# EAGLE design solar (EAGLE 6.5.0)
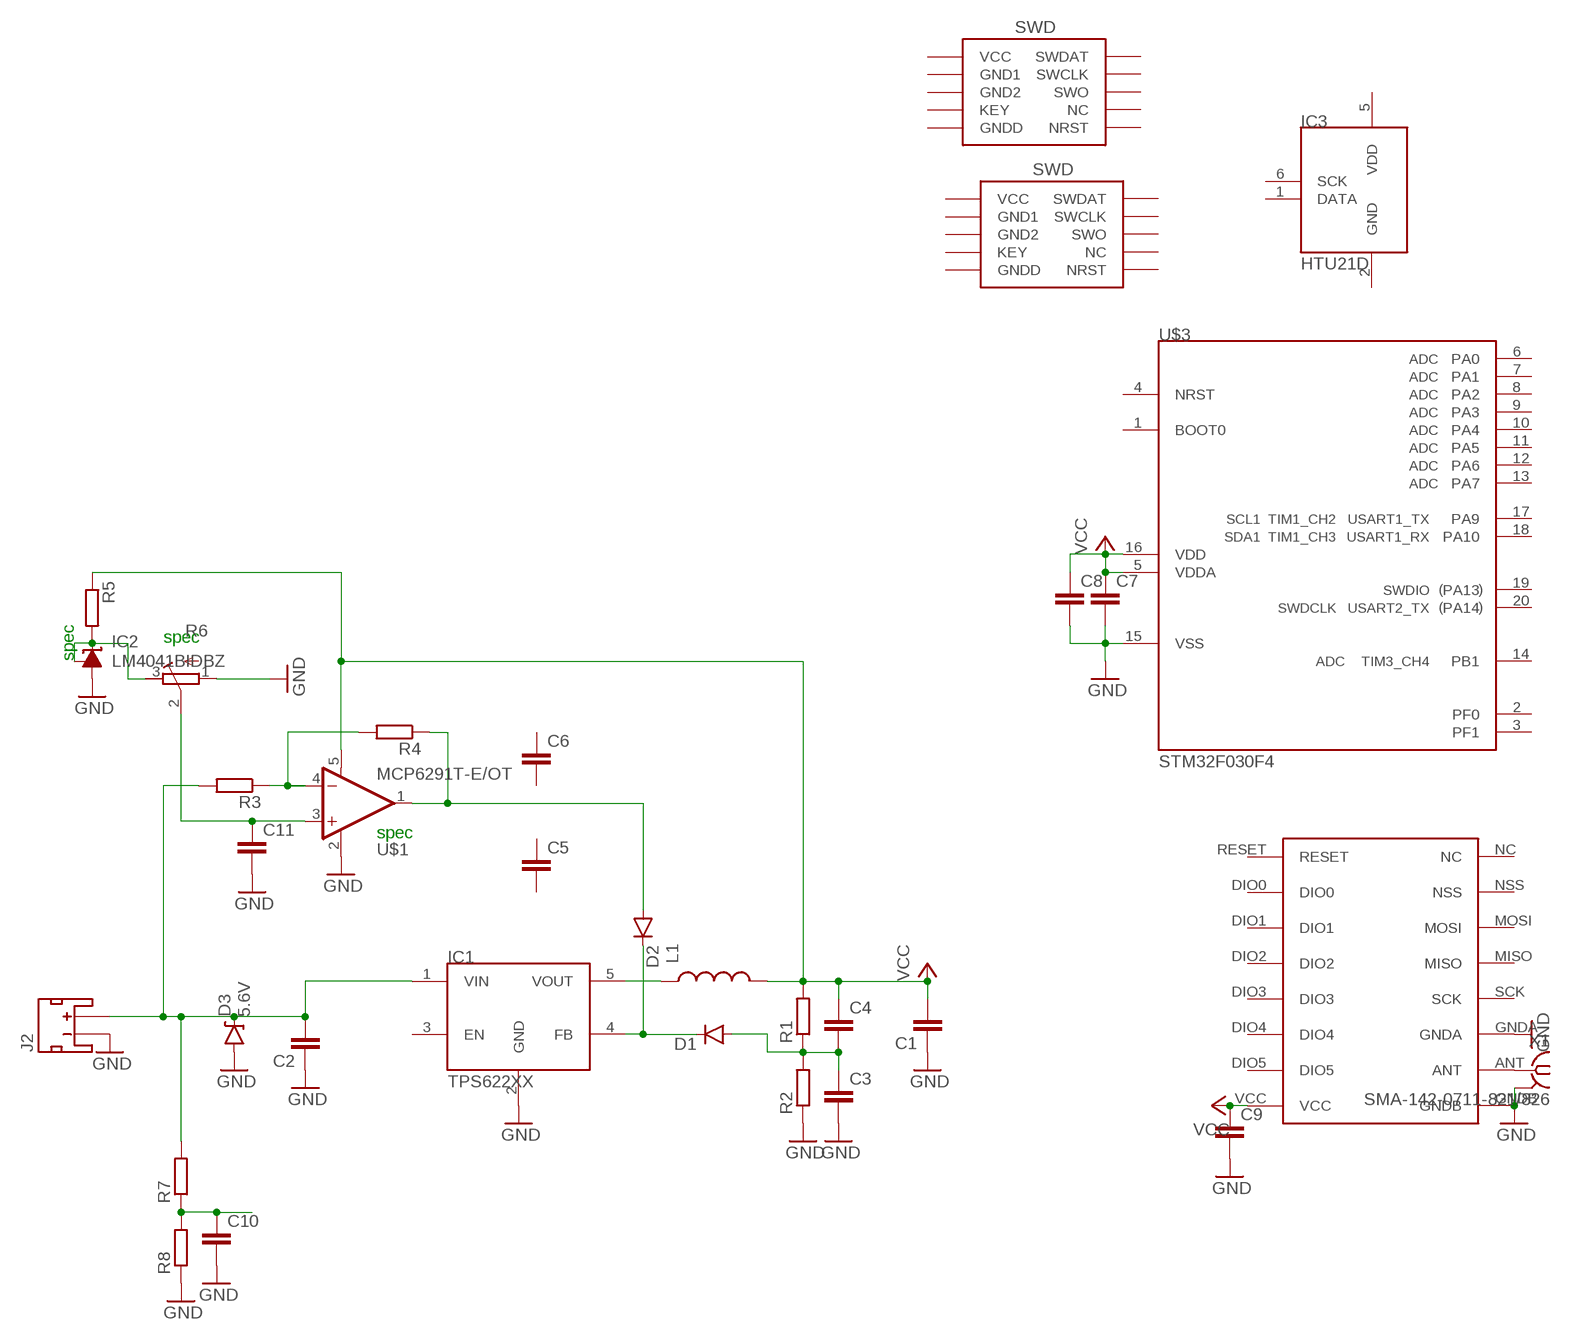
[diagram p0: schematic, sheet 1]

## Parts
C1  C-EUC0805  [C0805]
C2  C-EUC0805  [C0805]
C3  C-EUC0603  [C0603]
C4  C-EUC0603  [C0603]
C5  C-EUC0603  [C0603]
C6  C-EUC0603  [C0603]
C7  C-EUC0603  [C0603]
C8  C-EUC0603  [C0603]
C9  C-EUC0603  [C0603]
C10  C-EUC0603  [C0603]
C11  C-EUC0603  [C0603]
D1  250mA/100V  DIODEBAS16  [SOD-323]
D2  250mA/100V  DIODEBAS16  [SOD-323]
D3  5.6V  DIODE-ZENER5.6V  [SOD-323]
IC1  TPS622XX  [SOT23-5L]
IC2  LM4041BIDBZ  [DBZ_R-PDSO-G3]
IC3  HTU21D  [DFN6-L]
J1  SWD_SHROUD_SMD  [SWD_SMD_SHROUD]
J2  JST_2MM_MALE  [JST-2-SMD]
J3  SWD_SHROUD  [SWD_PTH_SHROUD]
L1  INDUCTOR1007  [1007]
R1  R-EU_R0603  [R0603]
R2  R-EU_R0603  [R0603]
R3  R-EU_R0603  [R0603]
R4  R-EU_R0603  [R0603]
R5  R-EU_R0603  [R0603]
R6  R-TRIMM3103  [RTRIM3103]
R7  R-EU_R0603  [R0603]
R8  R-EU_R0603  [R0603]
U$1  MCP6291T-E/OT  [SOT23-5]
U$3  STM32F030F4  [TSSOP20]
U$4  RFM69HW  [RFM]
X1  SMA-142-0711-821/826  [J502-ND-142-0711-821/826]

## Nets
GND: C1.1 C2.1 C3.2 C7.2 C8.2 C9.2 C10.2 C11.2 D3.A IC1.2(GND) IC2.3(A) J2.1(-) R2.1 R6.1(E) R8.1 U$1.2(V-) U$3.15(VSS) U$4.GNDA U$4.GNDB X1.G@1 X1.G@2 X1.G@3 X1.G@4
N$1: C3.1 C4.2 D1.A R1.1 R2.2
N$2: IC1.5(VOUT) L1.1
N$3: D1.C D2.C IC1.4(FB)
N$4: C2.2 D3.C IC1.1(VIN) J2.2(+) R3.2 R7.2
N$6: D2.A R4.1 U$1.1(OUT)
N$7: R3.1 R4.2 U$1.4(-IN)
N$8: C11.1 R6.2(S) U$1.3(+IN)
N$9: U$4.ANT X1.1
N$10: IC2.1(FB) IC2.2(C) R5.2 R6.3(A)
N$13: C10.1 R7.1 R8.2
VCC: C1.2 C4.1 C7.1 C8.1 C9.1 L1.2 R1.2 R5.1 U$1.5(V+) U$3.5(VDDA) U$3.16(VDD) U$4.VCC
Unconnected: C5.1 C5.2 C6.1 C6.2 IC1.3(EN) IC3.1(DATA) IC3.2(GND) IC3.5(VDD) IC3.6(SCK) J1.2(SWDAT) J1.4(SWCLK) J1.6(SWO) J1.7(KEY) J1.8(NC) J1.10(NRST) J2.NC1(PAD1) J2.NC2(PAD2) J3.2(SWDAT) J3.4(SWCLK) J3.6(SWO) J3.7(KEY) J3.8(NC) J3.10(NRST) U$3.1(BOOT0) U$3.2(PF0) U$3.3(PF1) U$3.4(NRST) U$3.6(PA0) U$3.7(PA1) U$3.8(PA2) U$3.9(PA3) U$3.10(PA4) U$3.11(PA5) U$3.12(PA6) U$3.13(PA7) U$3.14(PB1) U$3.17(PA9) U$3.18(PA10) U$3.19(PA13) U$3.20(PA14) U$4.DIO0 U$4.DIO1 U$4.DIO2 U$4.DIO3 U$4.DIO4 U$4.DIO5 U$4.MISO U$4.MOSI U$4.NC U$4.NSS U$4.RESET U$4.SCK

## Notes on the sheet
- spec
- spec
- spec

## Power pins joined to a net without a drawn wire
GND1: J1.3(GND1) J3.3(GND1)
GND2: J1.5(GND2) J3.5(GND2)
GNDD: J1.9(GNDD) J3.9(GNDD)
VCC: J1.1(VCC) J3.1(VCC)

## Library data of the parts
C1-C11 = rcl:C-EU: CAPACITOR, European symbol
D1 D2 = SparkFun-DiscreteSemi:DIODE: Diode These are standard reverse protection diodes and small signal diodes. SMA package can handle up to about 1A. SOD-323 can handle about 200mA. What the SOD-323 package when ordering, there are some mfgs out there that are 5-pin packages.; PROD_ID: DIO-09646
D3 = SparkFun-DiscreteSemi:DIODE-ZENER: Zener Diode Production Part - 8199 3.4V Zener Voltage; PROD_ID: DIO-12442
IC1 = Mine:TPS622XX
IC2 = texas:LM4041*I: PRECISION MICROPOWER SHUNT VOLTAGE REFERENCE Adjustable Output Source: http://focus.ti.com/lit/ds/slcs146e/slcs146e.pdf; OC_FARNELL: unknown; OC_NEWARK: unknown
IC3 = Mine:HTU21D
J1 J3 = dtb:SWD_SHROUD
J2 = dtb:JST_2MM_MALE: Mates to single-cell LiPo batteries. CONN-08352; PROD_ID: CONN-08352
L1 = SparkFun-Passives:INDUCTOR: Inductors Basic Inductor/Choke - 0603 and 1206. Footprints are not proven and vary greatly between part numbers. SRN6045- 33uH, 20% 1.4A SDR0403-560KL - 56uH, 10%, 500mA RMS/740mA peak
R1-R5 R7 R8 = rcl:R-EU_: RESISTOR, European symbol
R6 = resistor:R-TRIMM: Trimm resistor
U$1 = SparkFun-AnalogIC:MCP6291: Rail to rail OpAmp with 10MHz GBP; PROD_ID: IC-11991
U$3 = dtb:STM32F030F4
U$4 = hoperf:RFM69HW
X1 = con-coax:SMA-: SMA 50 Ohm End Launch Jack Receptacle - Round Contact Johnson Components Source: www.johnsoncomponents.com .. J502-ND.pdf; MF: JOHNSON COMPONENTS; MPN: 142-0711-821; OC_FARNELL: 1019328; OC_NEWARK: 16F3627

## Board
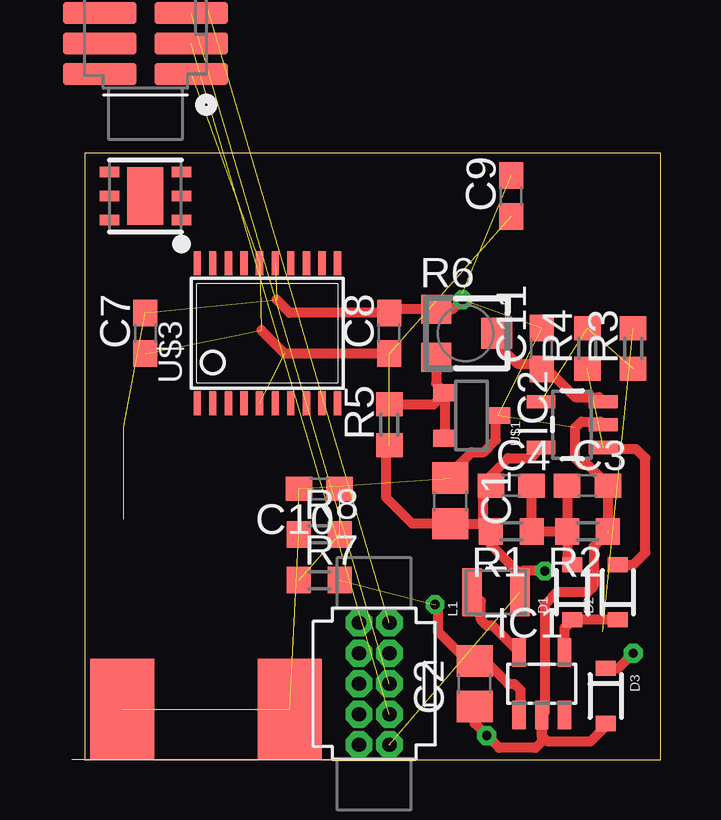
[diagram p1: board, top side]
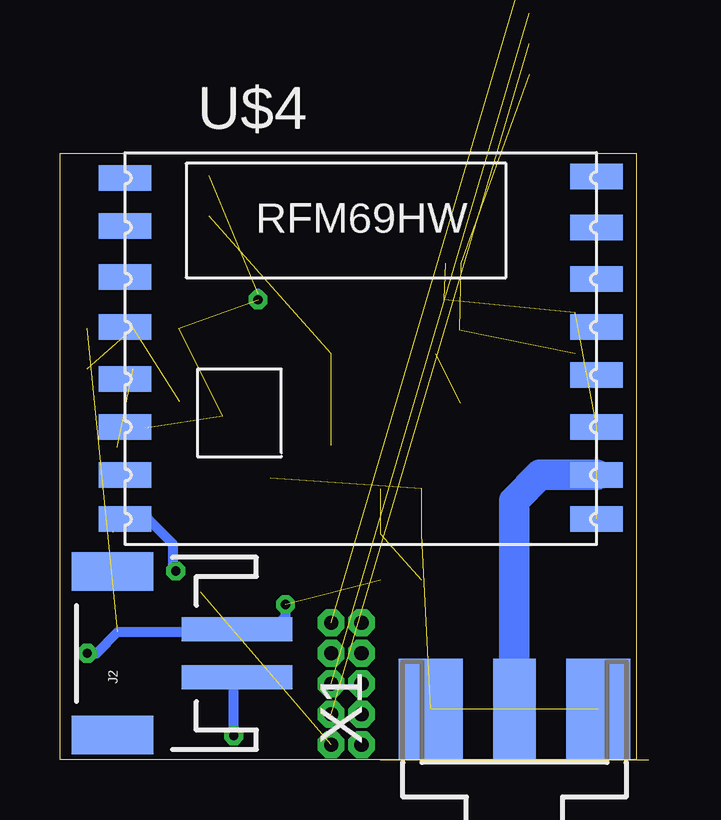
[diagram p2: board, bottom side, seen from below]

Size 24 x 25.27 mm. Coordinates in mm from the lower left corner, seen from the top.
Outline: 0,0 24,0 24,25.27 0,25.27 0,0
Copper layers (1*16): Top 0.035mm / dielectric 1.5mm / Bottom 0.035mm
Design rules "default": minimum track width 10mil, minimum drill 24mil, track to track 8mil, track to pad 8mil, pad to pad 8mil, via to via 8mil, smd to smd 8mil, copper to edge 40mil, drill to drill 8mil, minimum pad ring 10mil, minimum via ring 8mil, stop-mask expansion 4mil, vias tented up to drill 0mil, thermal gap 10mil

### Footprints (pad centres in the part's own frame; a part is rotated, then mirrored left to right if it is on the bottom)
C0805 = smd 1.3 x 1.5: 1 -0.95,0; 2 0.95,0
C0603 = smd 1.1 x 1: 1 -0.85,0; 2 0.85,0
SOD-323 = smd 0.63 x 0.83: A 1.15,0; C -1.15,0
SOT23-5L = smd 0.55 x 1.2: 1 -0.95,-1.3; 2 0,-1.3; 3 0.95,-1.3; 4 0.95,1.3; 5 -0.95,1.3
DBZ_R-PDSO-G3 = smd 0.7 x 1: 1 -0.95,-1.1; 2 0.95,-1.1; 3 0,1.1
DFN6-L = smd 0.45 x 0.8: 1 -1,-1.5; 2 0,-1.5; 3 1,-1.5; 4 1,1.5; 5 0,1.5; 6 -1,1.5 | smd 2.4 x 1.5: EP 0,0
SWD_SMD_SHROUD = smd 0.914 x 3.048: 1 -2.54,-1.905; 2 -2.54,1.905; 3 -1.27,-1.905; 4 -1.27,1.905; 5 0,-1.905; 6 0,1.905; 7 1.27,-1.905; 8 1.27,1.905; 9 2.54,-1.905; 10 2.54,1.905
JST-2-SMD = smd 1 x 4.6: 1 -1,-3.7; 2 1,-3.7 | smd 1.6 x 3.4: NC1 -3.4,1.5; NC2 3.4,1.5
SWD_PTH_SHROUD = drill 0.6 octagon: 1 -2.54,-0.635; 2 -2.54,0.635; 3 -1.27,-0.635; 4 -1.27,0.635; 5 0,-0.635; 6 0,0.635; 7 1.27,-0.635; 8 1.27,0.635; 9 2.54,-0.635; 10 2.54,0.635
1007 = smd 2 x 0.8: 1 0,1; 2 0,-1
R0603 = smd 1 x 1.1: 1 -0.85,0; 2 0.85,0
RTRIM3103 = smd 1.2 x 1.25: 1 -1,-1.225; 3 1,-1.225 | smd 1.3 x 1.3: 2 0,1.3
SOT23-5 = smd 0.55 x 1.2: 1 -0.95,-1.3; 2 0,-1.3; 3 0.95,-1.3; 4 0.95,1.3; 5 -0.95,1.3
TSSOP20 = smd 0.305 x 0.991: 1 -2.925,-2.918; 2 -2.275,-2.918; 3 -1.625,-2.918; 4 -0.975,-2.918; 5 -0.325,-2.918; 6 0.325,-2.918; 7 0.975,-2.918; 8 1.625,-2.918; 9 2.275,-2.918; 10 2.925,-2.918; 11 2.925,2.918; 12 2.275,2.918; 13 1.625,2.918; 14 0.975,2.918; 15 0.325,2.918; 16 -0.325,2.918; 17 -0.975,2.918; 18 -1.625,2.918; 19 -2.275,2.918; 20 -2.925,2.918
RFM = smd 2.184 x 1.067: ANT 19.651,2.889; DIO0 0,13.27; DIO1 0,11.143; DIO2 0,9.047; DIO3 0,6.889; DIO4 0,4.889; DIO5 0,2.889; GNDA 19.651,4.889; GNDB 19.651,1.048; MISO 19.651,9.047; MOSI 19.651,11.047; NC 19.651,15.334; NSS 19.651,13.206; RESET 0,15.27; SCK 19.651,7.048; VCC 0,1.048
J502-ND-142-0711-821/826 = smd 4.191 x 1.778: 1 2.115,0 | smd 4.191 x 2.667: G@1 2.115,3.495; G@2 2.115,-3.495 | smd 4.191 x 2.667 bottom: G@3 2.115,3.495; G@4 2.115,-3.495

### Placement (x,y rotation side)
C1  15.24,10.79 270 top
C2  16.26,3.17 90 top
C3  20.95,11.43 0 top
C4  17.78,11.43 0 top
C5  -40.64,40.64 0 top  (outside the outline)
C6  -44.45,40.64 0 top  (outside the outline)
C7  2.54,17.78 90 top
C8  12.7,17.78 90 top
C9  17.78,23.5 90 top
C10  9.78,11.3 180 top
C11  19.05,17.14 90 top
D1  20.32,6.99 90 top
D2  22.23,6.99 90 top
D3  21.72,2.67 270 top
IC1  19.05,3.17 0 top
IC2  16.13,14.35 270 top
IC3  2.54,23.5 90 top
J1  2.54,31.11 90 top  (outside the outline)
J2  20.32,4.45 90 bottom
J3  12.06,3.17 90 top
L1  17.14,6.99 90 top
R1  17.78,9.53 180 top
R2  20.95,9.53 180 top
R3  22.86,17.14 90 top
R4  20.95,17.14 90 top
R5  12.7,13.97 90 top
R6  15.88,17.78 270 top
R7  9.78,7.49 0 top
R8  9.78,9.4 0 top
U$1  20.32,13.97 90 top
U$3  7.62,17.78 0 top
U$4  21.29,8.98 0 bottom
X1  5.07,0 90 bottom

### Tracks (layer width: path | path; a pad name or v marks a point on that pad's centre or on a via)
GND  (via drill 0.38)  (15 unrouted)
  Top 0.406: IC1.2 19.05,1.02 19.3,0.76 21.08,0.76 21.72,1.4 D3.A | IC1.2 19.05,0.76 18.8,0.51 17.27,0.51 v16.76,1.02 16.26,1.52 C2.1 | U$1.2 21.49,14.1 20.7,14.1 20.45,13.84 20.45,12.57 20.7,12.32 20.95,12.32 21.8,11.47 C3.2 21.8,9.49 21.21,8.89 21.21,7.24 20.95,6.99 19.68,6.99 19.18,6.48 19.18,2 IC1.2 | C1.1 15.24,11.94 16.13,12.83 16.64,12.83 17.14,13.34 17.14,14.27 IC2.3 | 8,19.18 8.55,18.63 C8.2 12.85,18.78 R6.1 15.35,18.78 v15.75,19.18
  Bottom 0.406: v16.76,1.02 16.76,3.3 J2.1 | v15.75,19.18 15.75,19.43
GND1  (1 unrouted)
GND2  (1 unrouted)
GNDD  (1 unrouted)
N$1
  Top 0.406: R2.2 20.11,8.35 D1.A | R2.2 R1.1 C4.2 | C3.1 R2.2
N$2
  Top 0.406: IC1.5 18.1,4.51 17.02,5.59 16.76,5.59 16.51,5.84 16.51,6.62 L1.1
N$3
  Top 0.406: IC1.4 20,5.51 D1.C D2.C
N$4  (via drill 0.38)  (2 unrouted)
  Top 0.406: v22.86,4.45 22.23,3.81 22.22,3.82 D3.C | IC1.1 18.16,1.94 18.16,2.92 17.91,3.17 17.65,3.17 16.7,4.12 C2.2 15.94,4.12 14.73,5.33 14.73,6.35 v14.61,6.48
  Bottom 0.406: v22.86,4.45 22.48,4.45 21.59,5.33 17.53,5.33 17.27,5.59 16.76,5.59 J2.2 16.48,5.59 14.99,5.59 14.61,5.97 v14.61,6.48
N$6  (1 unrouted)
  Top 0.406: D2.A 22.87,8.13 23.37,8.64 23.37,12.57 22.99,12.95 21.69,12.95 U$1.1
N$7  (2 unrouted)
N$8
  Top 0.406: R6.2 17.18,17.37 18.03,16.51 18.84,16.51 C11.1 19.27,16.3 20.45,15.11 21.43,15.11 U$1.3
N$9
  Bottom 1.27: U$4.ANT 4,11.87 5.08,10.79 X1.1
N$10
  Top 0.406: IC2.2 IC2.1 | R5.2 14.55,14.82 IC2.1 | R6.3 14.65,15.68 IC2.1
N$13  (2 unrouted)
VCC  (via drill 0.38)  (7 unrouted)
  Top 0.406: 16.61,9.85 C1.2 13.65,9.85 12.57,10.92 12.57,12.99 R5.1 | 16.61,9.85 R1.2 16.89,9.49 16.89,9.02 18.14,7.76 | 16.61,9.85 16.61,11.11 C4.1 16.93,11.85 17.65,12.57 18.57,12.57 U$1.5 | L1.2 18.14,7.76 | C8.1 8.34,16.93 7.37,17.91 | v19.18,7.87 18.26,7.87 18.14,7.76
  Bottom 0.406: U$4.VCC 20.32,10.03 19.3,9.02 19.3,8 v19.18,7.87